# Altium project NIR-Spec-Sensor-Board.PrjPcb
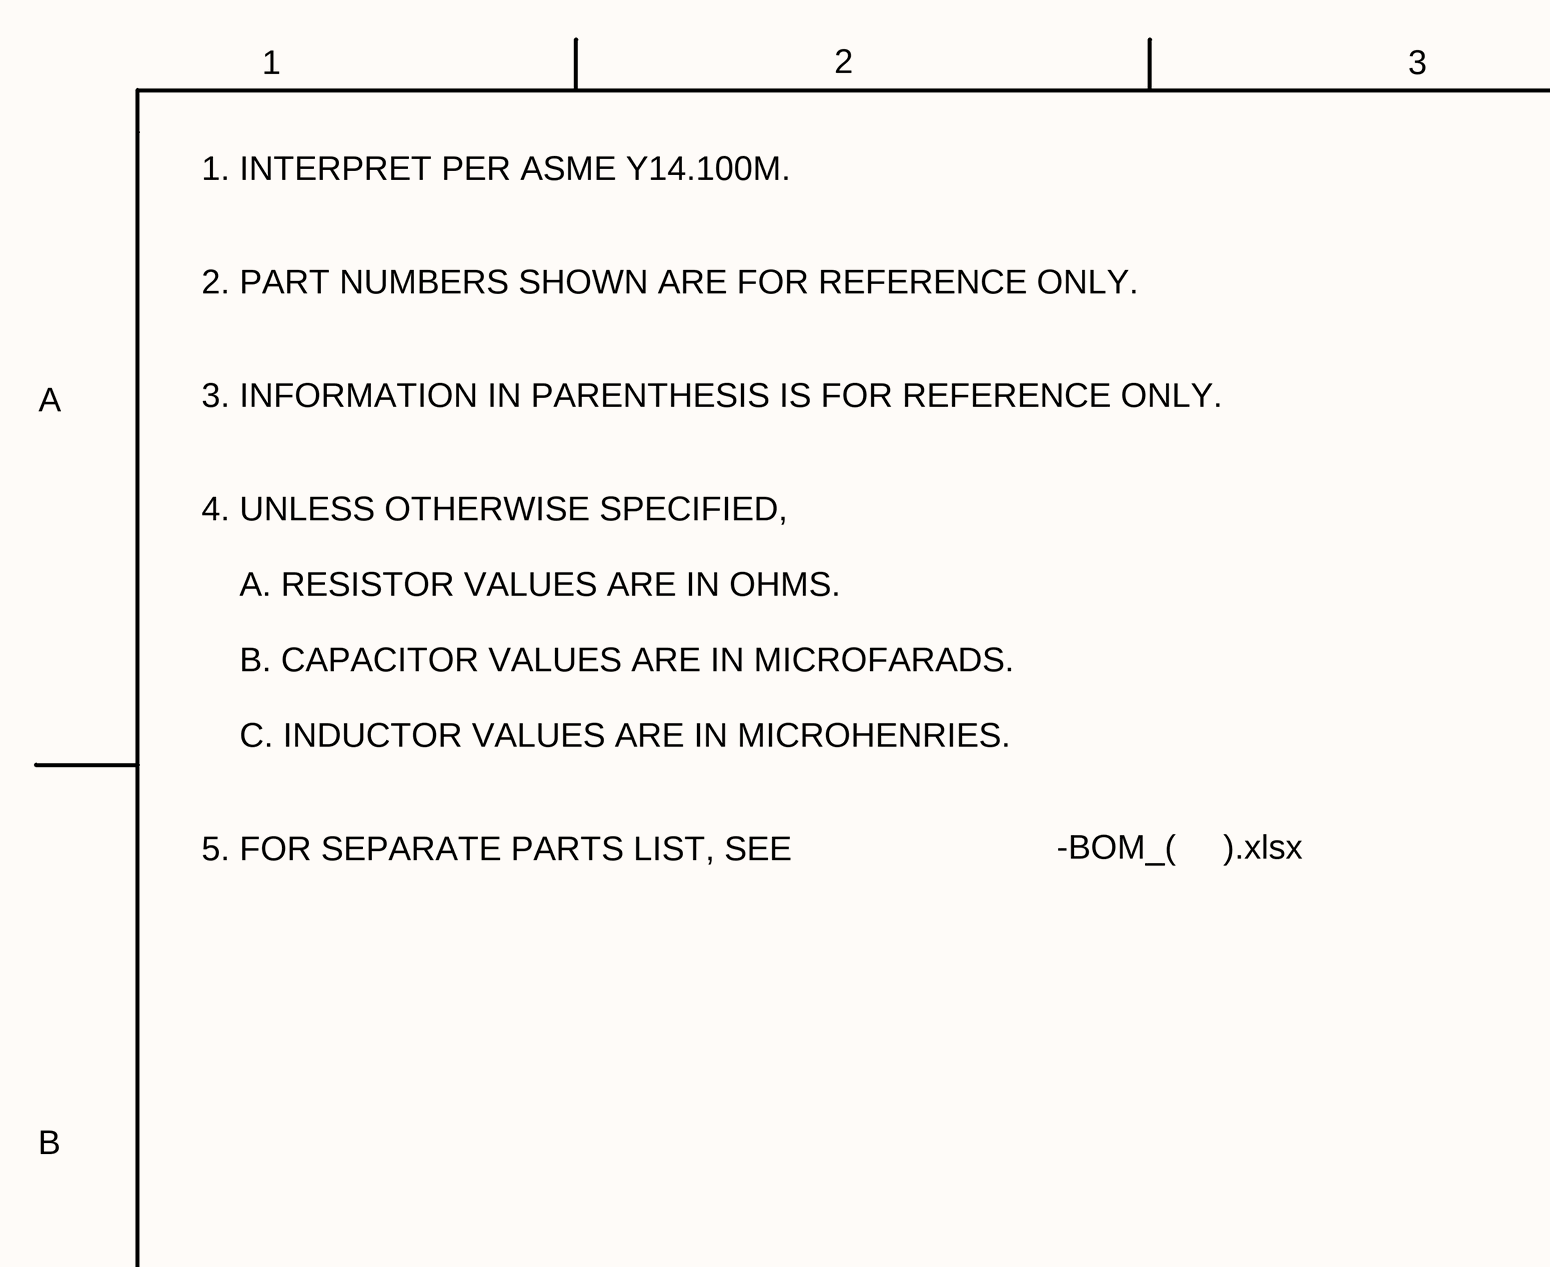
[diagram p0: G8160-03-Sensor-Board-SCH_SH1_(02).SchDoc, top left]
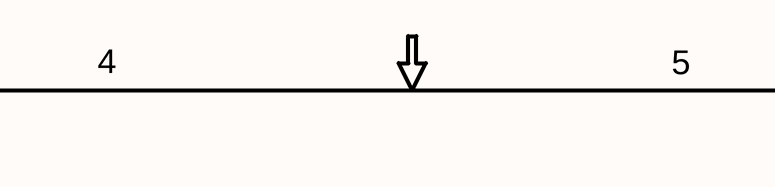
[diagram p1: G8160-03-Sensor-Board-SCH_SH1_(02).SchDoc, top middle]
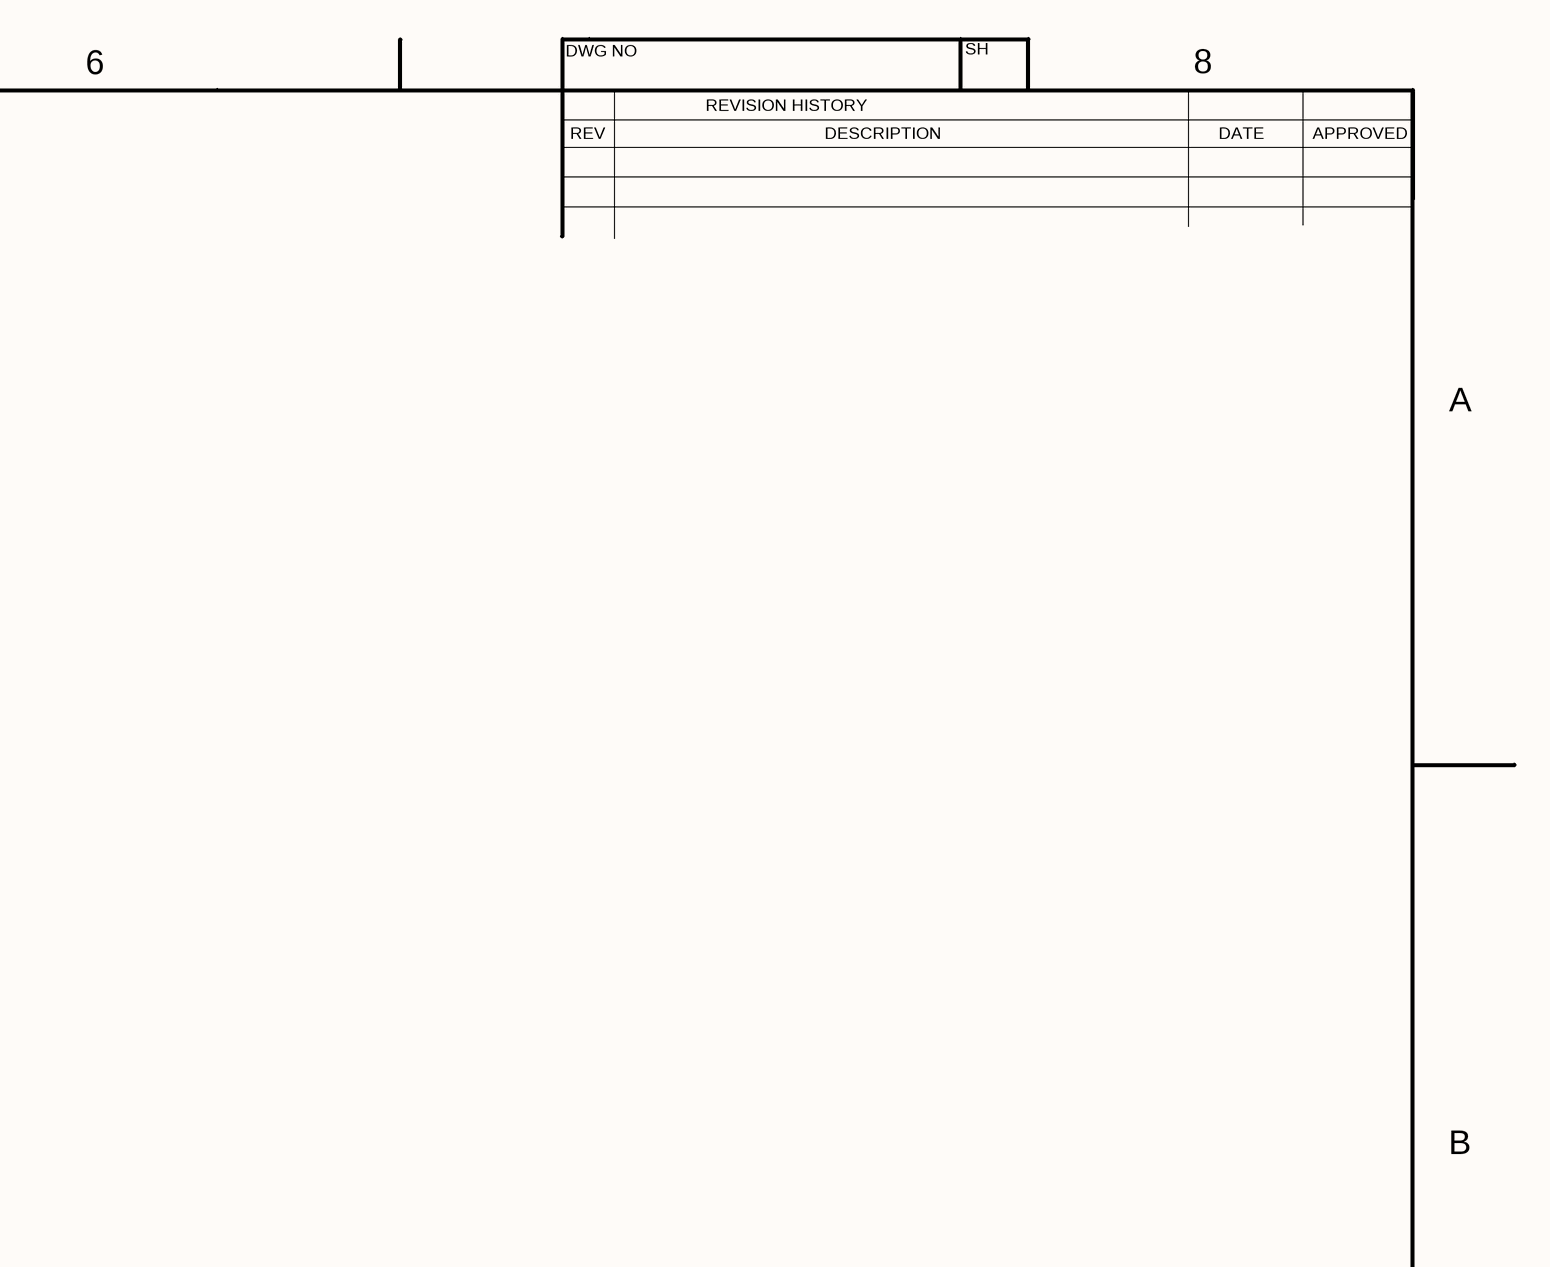
[diagram p2: G8160-03-Sensor-Board-SCH_SH1_(02).SchDoc, top right]
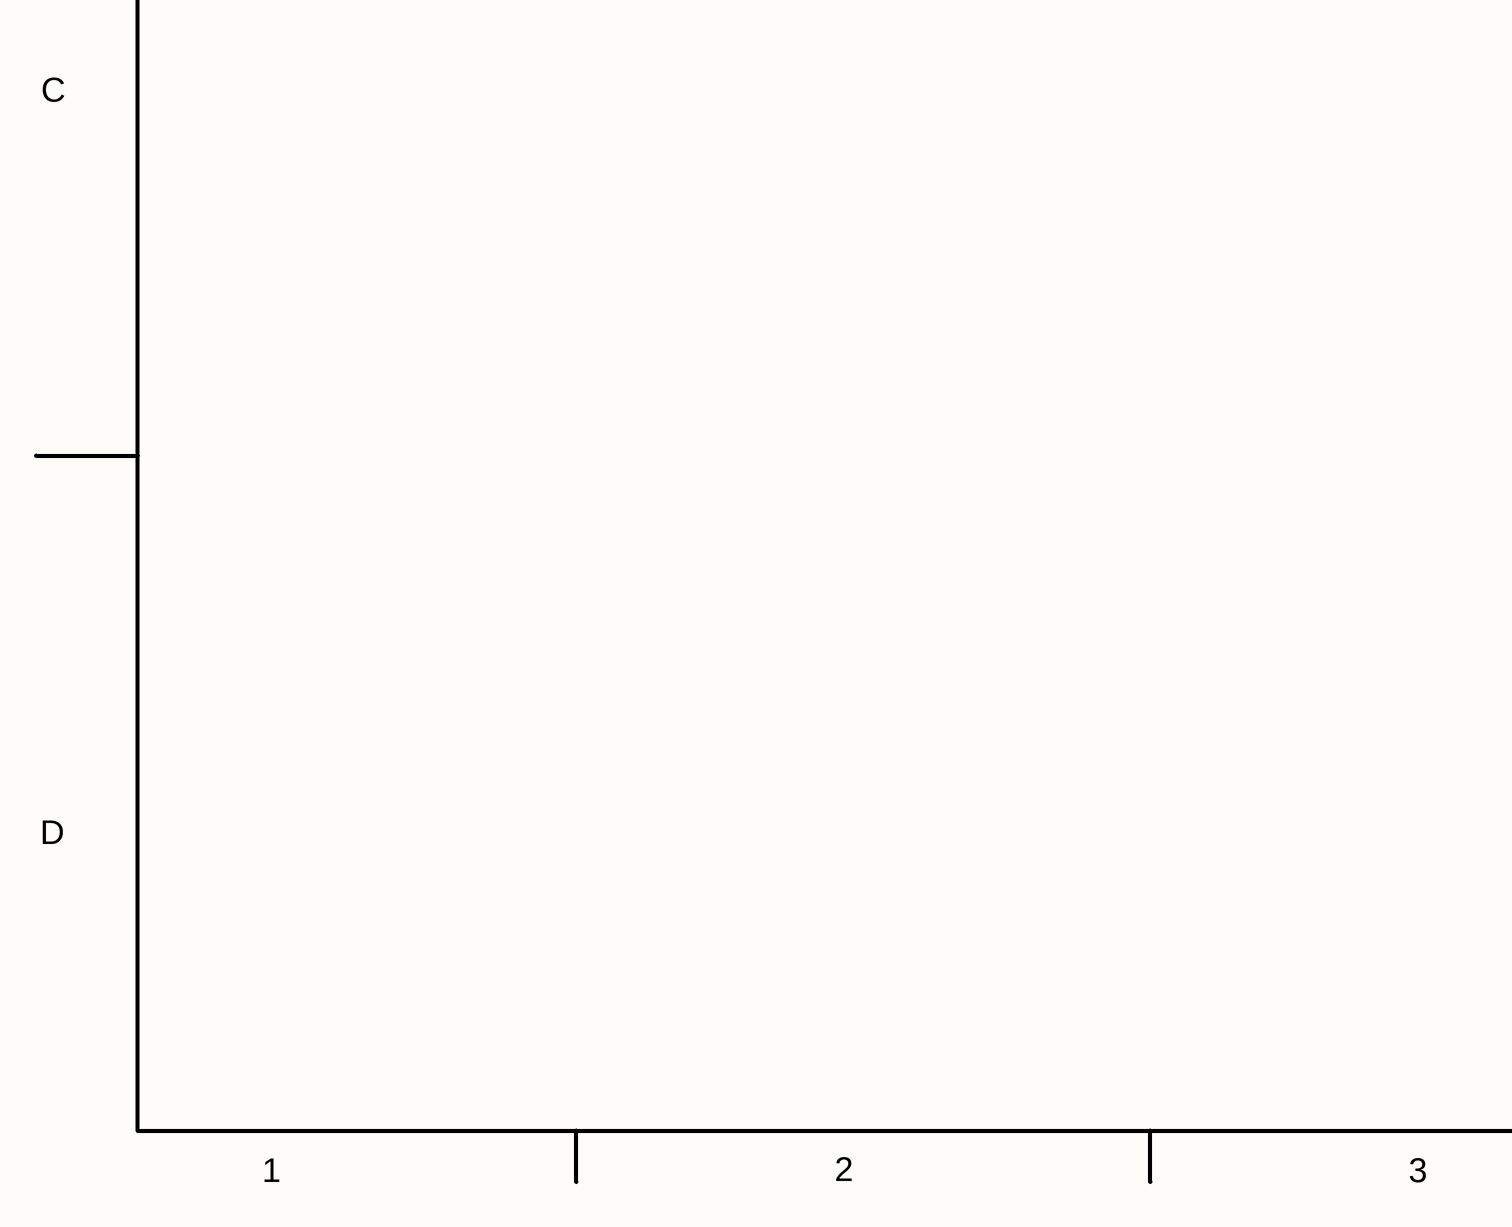
[diagram p3: G8160-03-Sensor-Board-SCH_SH1_(02).SchDoc, bottom left]
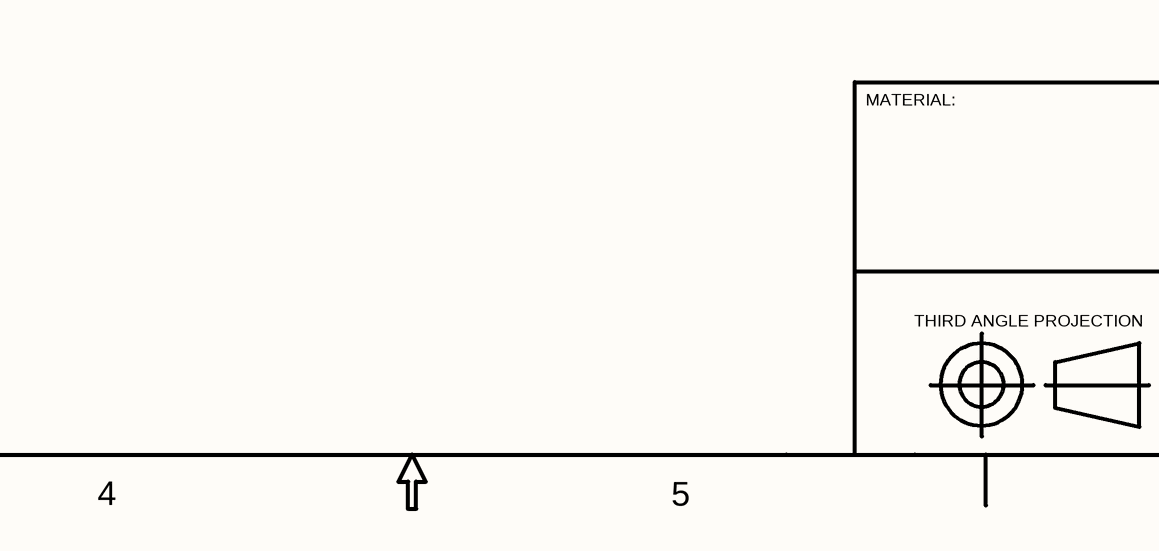
[diagram p4: G8160-03-Sensor-Board-SCH_SH1_(02).SchDoc, bottom middle]
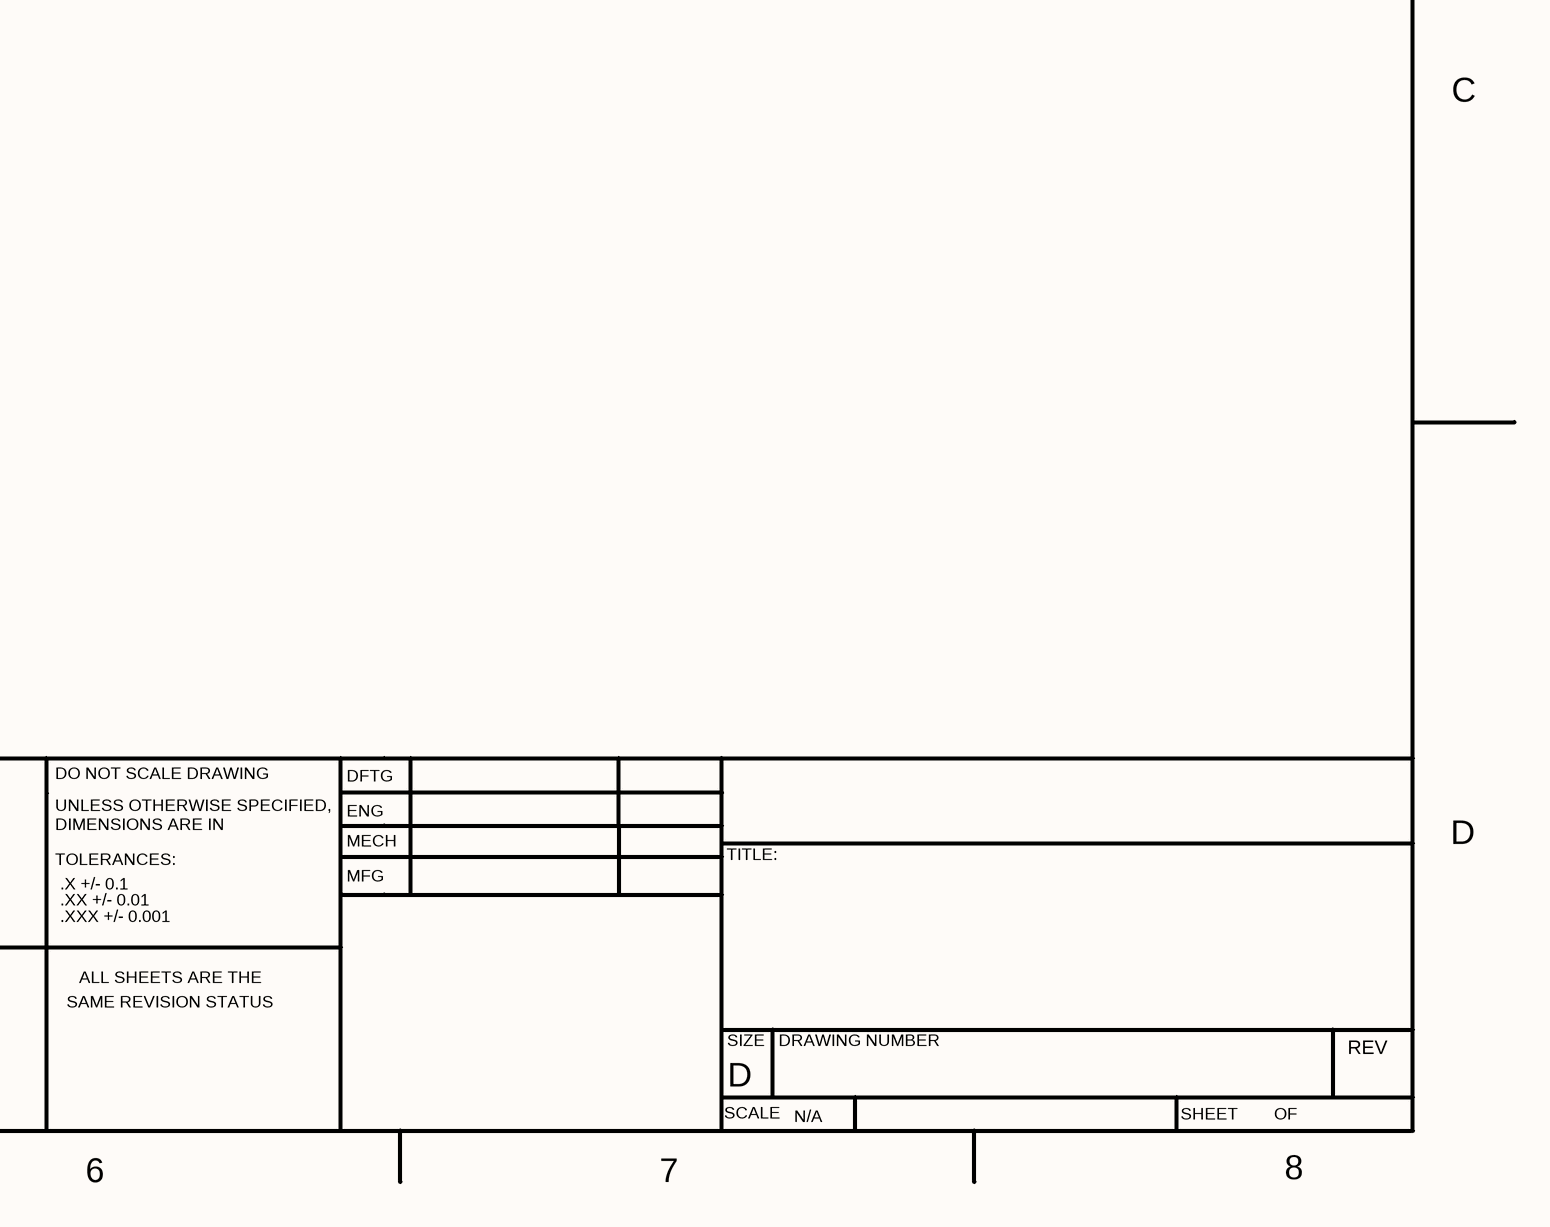
[diagram p5: G8160-03-Sensor-Board-SCH_SH1_(02).SchDoc, bottom right]
Company: -; DateDftg: -; DateEng: 06/13/22; DocNumber: NIR-Spec-Sensor; DocNumberPCB: NIR-Spec-Sensor-PCB; Hist1Appr: -; Hist1Date: -; Hist1Desc: -; Hist1Rev: -; Hist2Appr: -; Hist2Date: -; Hist2Desc: -; Hist2Rev: -; Hist3Appr: -; Hist3Date: -; Hist3Desc: -; Hist3Rev: -; NameDftg: K. KIDD; NameEng: K. KIDD; Rev: 02; Title0: NIR Spec; Title1: G8160-3 Sensor Board; TitleCCA: CIRCUIT CARD ASSEMBLY,; TitlePCB: PRINTED CIRCUIT BOARD,; TitleSCH: SCHEMATIC, CCA,
2 sheets, 15 parts. Net scope: global (net labels, ports and power ports of the same name join across sheets).
Board file: G8160-03-Sensor-Board.PcbDoc
Sheets:
  G8160-03-Sensor-Board-SCH_SH1_(02).SchDoc
  G8160-03-Sensor-Board-SCH_SH2_(02).SchDoc

## Sheet G8160-03-Sensor-Board-SCH_SH1_(02).SchDoc: SCHEMATIC, CCA,
size 863 x 558 mm; DocumentNumber: XXX-20XXX-XXX; SheetNumber: 1; SheetTotal: 2

### Notes on the sheet
- 1
- 2
- 3
- 4
- 5
- 6
- DWG NO
- REVISION HISTORY
- SH
- 8
- REV
- DESCRIPTION
- DATE
- APPROVED
- A
- -BOM_(
- ).xlsx
- 1. INTERPRET PER ASME Y14.100M.
  2. PART NUMBERS SHOWN ARE FOR REFERENCE ONLY.
  3. INFORMATION IN PARENTHESIS IS FOR REFERENCE ONLY.
  4. UNLESS OTHERWISE SPECIFIED,
  A. RESISTOR VALUES ARE IN OHMS.
  B. CAPACITOR VALUES ARE IN MICROFARADS.
  C. INDUCTOR VALUES ARE IN MICROHENRIES.
  5. FOR SEPARATE PARTS LIST, SEE
- B
- C
- MATERIAL:
- DO NOT SCALE DRAWING
- UNLESS OTHERWISE SPECIFIED,
- ENG
- DFTG
- D
- DIMENSIONS ARE IN
- TOLERANCES:
- MECH
- MFG
- TITLE:
- .X +/- 0.1
- .XX +/- 0.01
- .XXX +/- 0.001
- THIRD ANGLE PROJECTION
- SAME REVISION STATUS
- ALL SHEETS ARE THE
- SIZE
- DRAWING NUMBER
- SCALE
- N/A
- SHEET        OF
- 7

## Sheet G8160-03-Sensor-Board-SCH_SH2_(02).SchDoc: SCHEMATIC
size 863 x 558 mm; DocumentNumber: XXX-20XXX-XXX; SheetNumber: 2; SheetTotal: 2; PageSetup: Record=PageOptions|CenterHorizontal=True|CenterVertical=True|PrintScale=0.98|XCorrection=1.00|YCorrection=1.00|PrintKind=2|BorderSize=5000000|LeftOffset=0|BottomOffset=0|Orientation=2|PaperLength=1000|PaperWidth=1000|Scale=100|PaperSource=15|PrintQuality=1200|MediaType=1|DitherType=10|PaperKind=11 x 17|PrintScaleMode=1
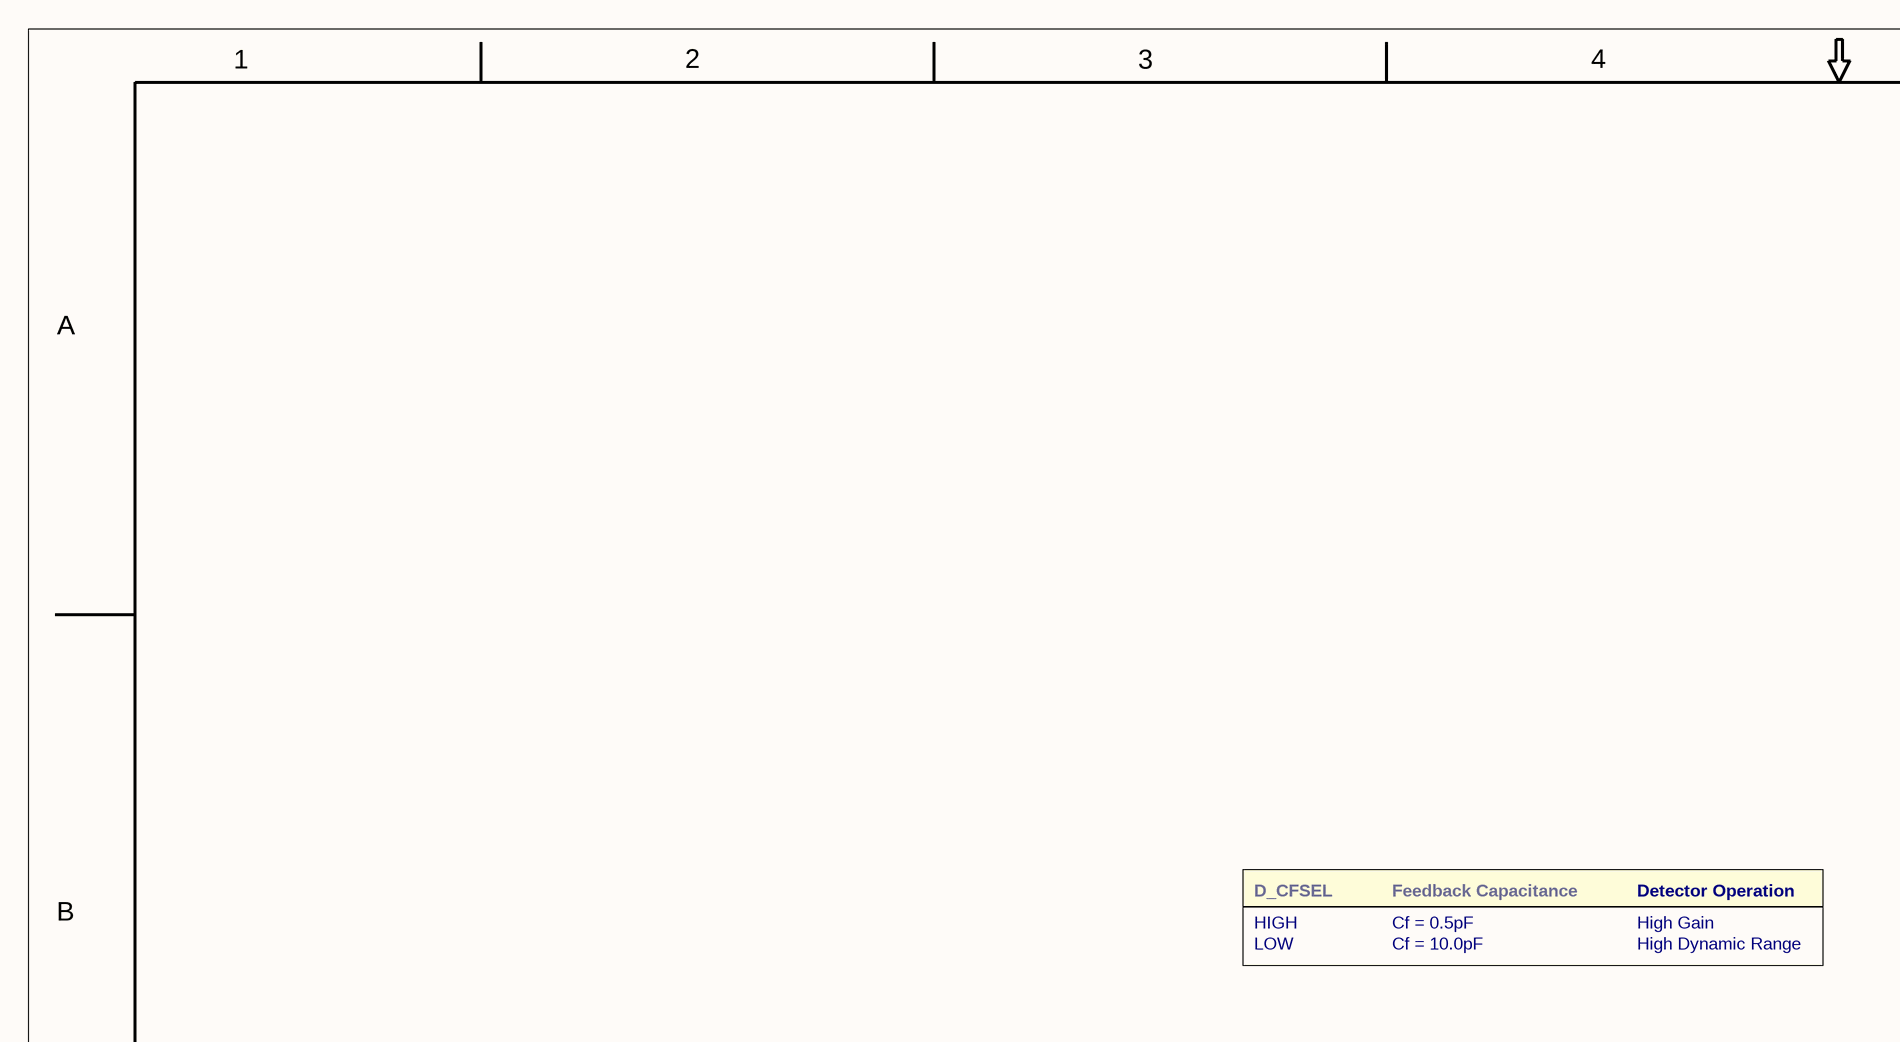
[diagram p6: G8160-03-Sensor-Board-SCH_SH2_(02).SchDoc, top left]
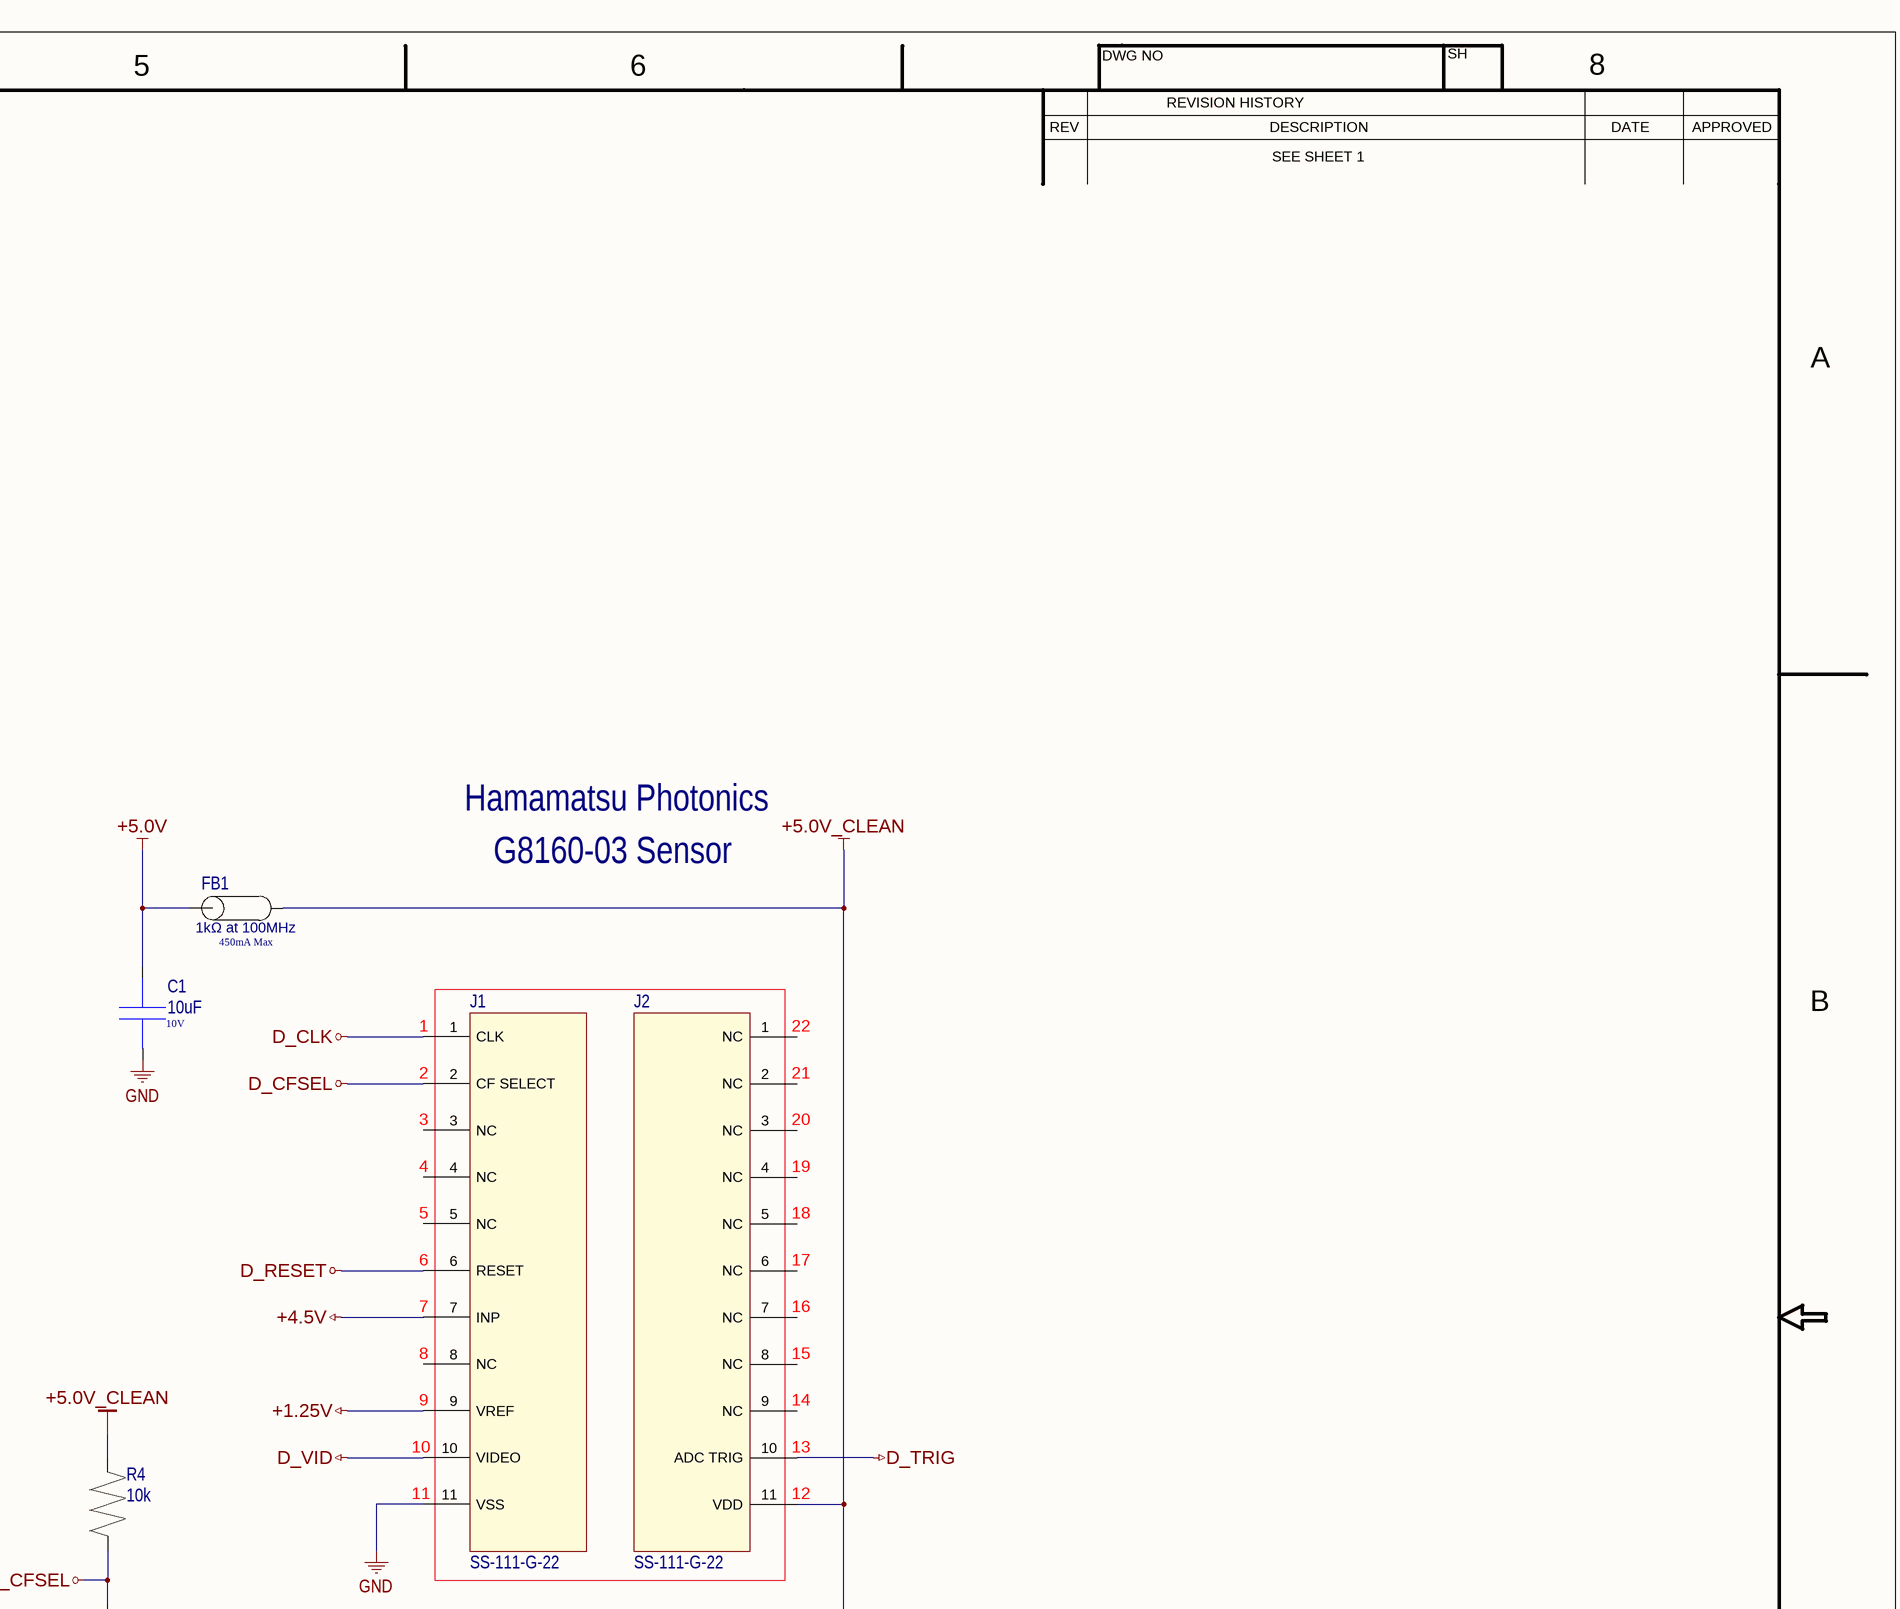
[diagram p7: G8160-03-Sensor-Board-SCH_SH2_(02).SchDoc, top right]
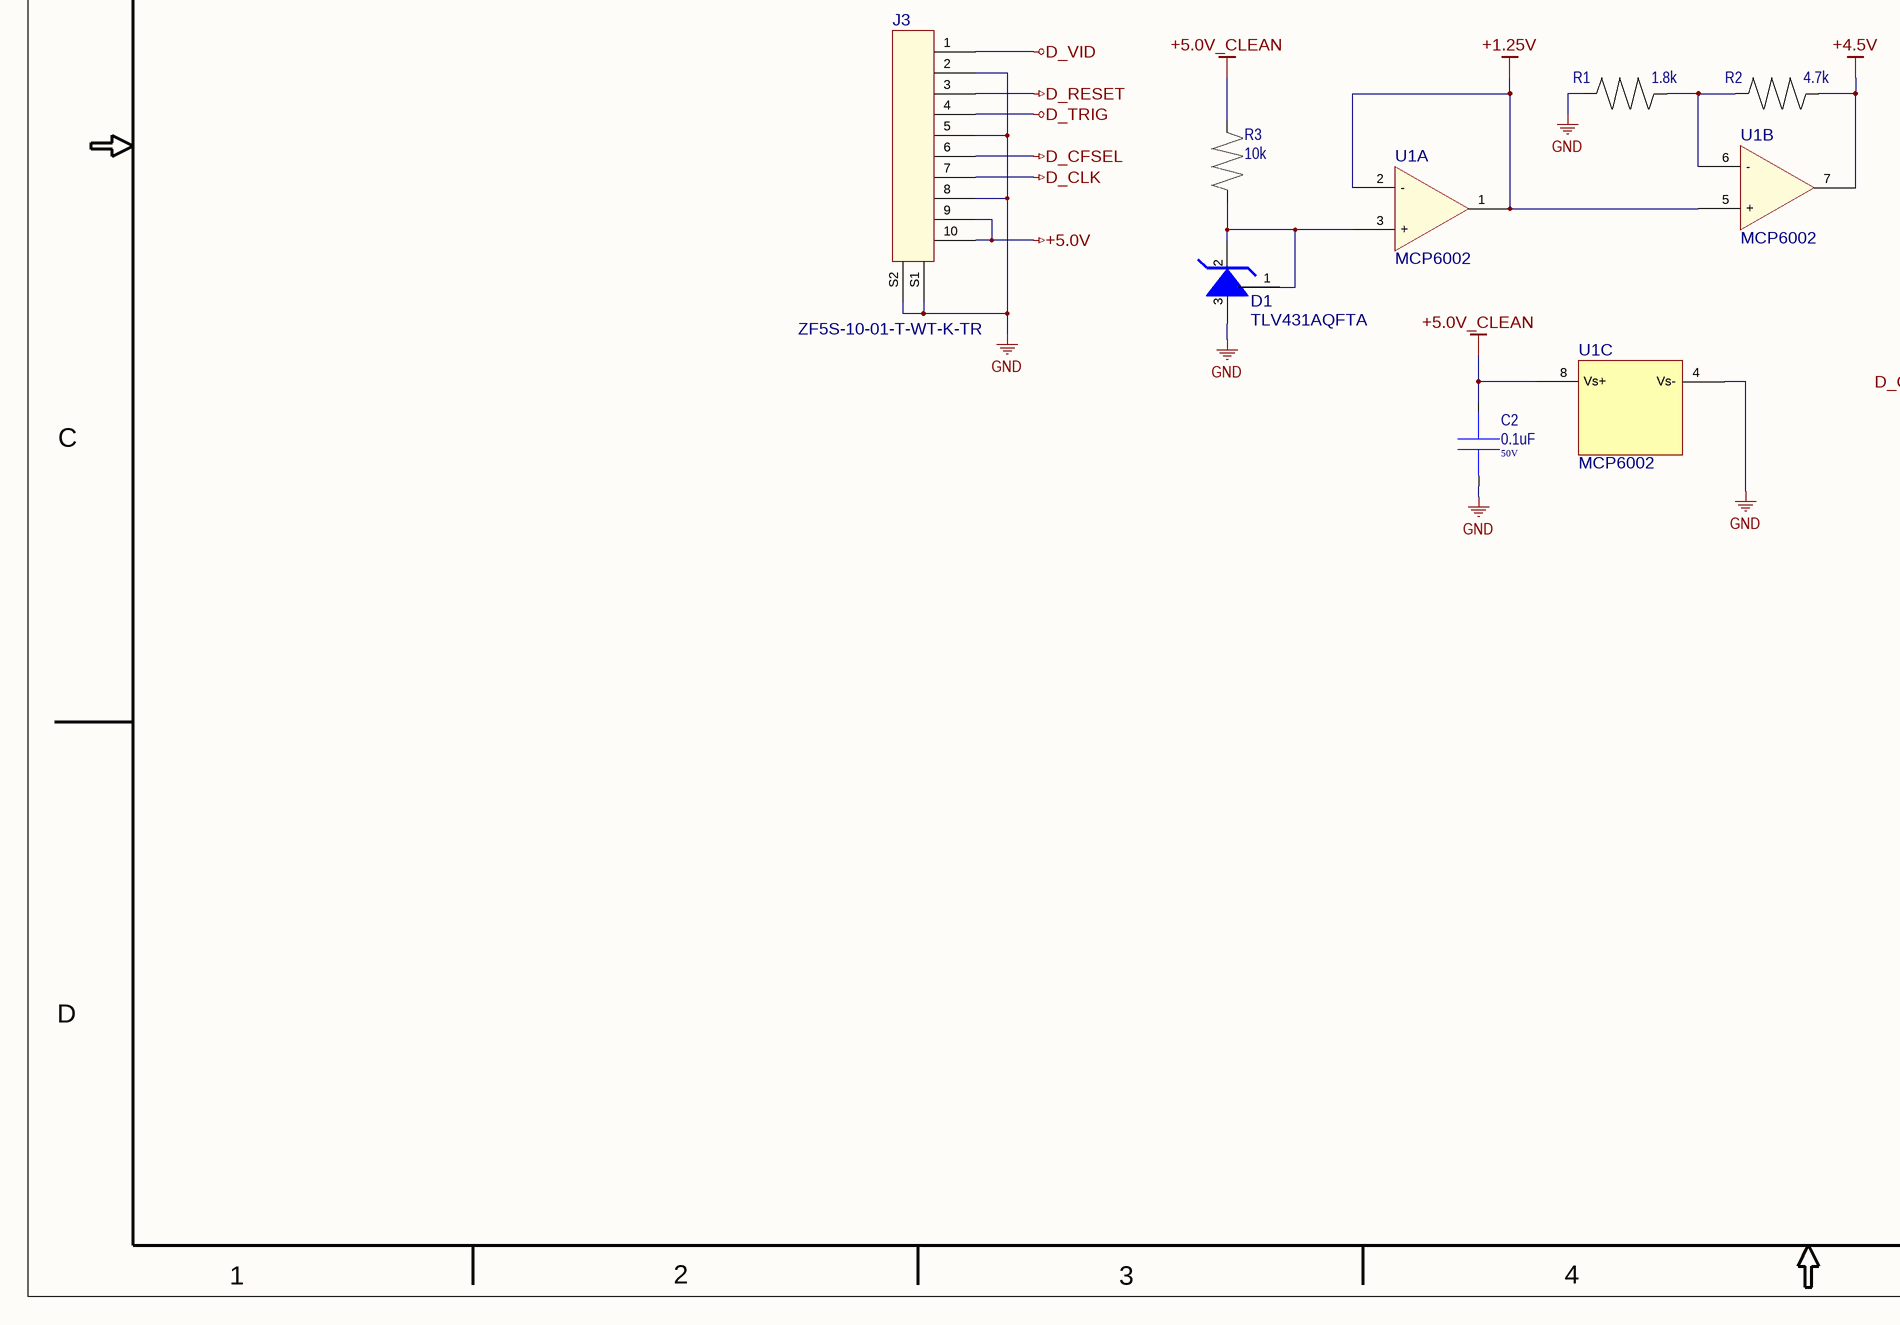
[diagram p8: G8160-03-Sensor-Board-SCH_SH2_(02).SchDoc, bottom left]
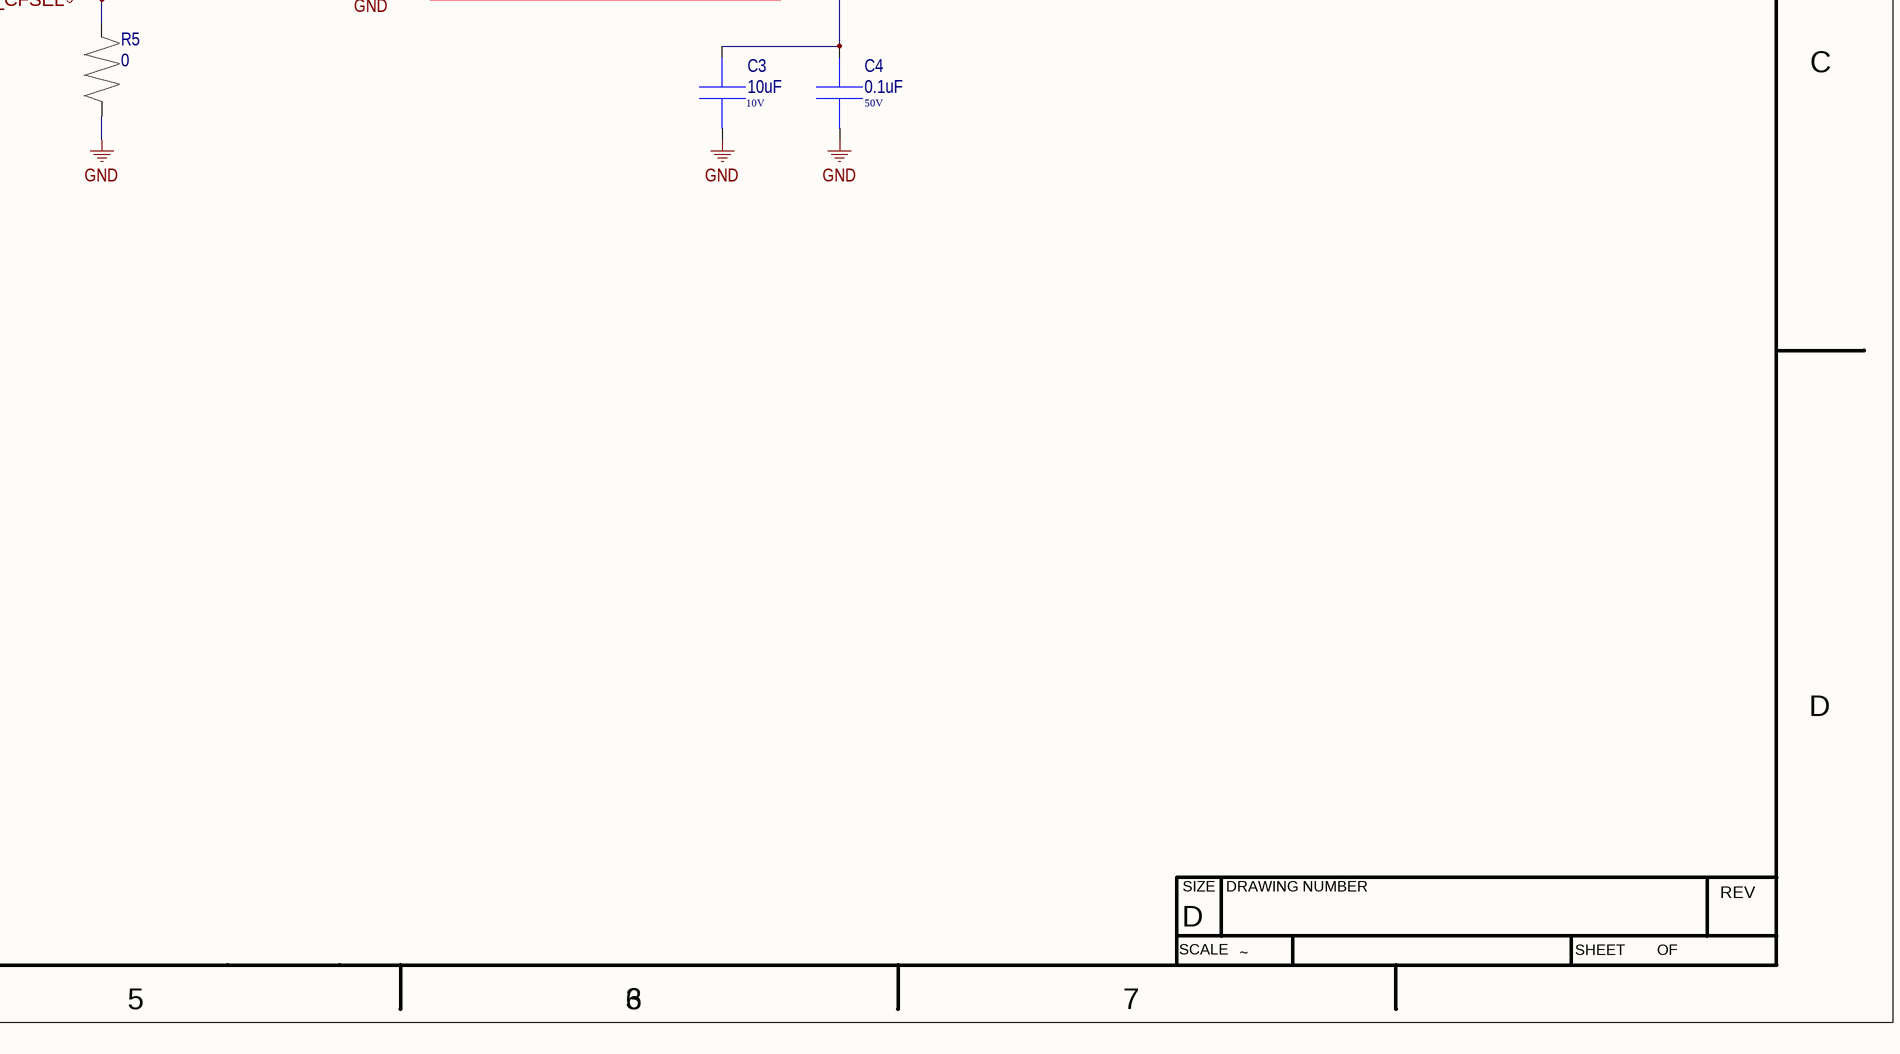
[diagram p9: G8160-03-Sensor-Board-SCH_SH2_(02).SchDoc, bottom right]

### Parts
C1  10uF  Voltage: 10V  [0402]
C2  0.1uF  Voltage: 50V  [0402]
C3  10uF  Voltage: 10V  [0402]
C4  0.1uF  Voltage: 50V  [0402]
D1  TLV431AQFTA  [SOT-23-3]
FB1  Rated Current: 450mA Max  Impedance: 1kΩ at 100MHz  [0402]  (hidden comment: Ferrite_Bead)
J1  SS-111-G-22  [SL-111-TT-11]
J2  SS-111-G-22  [SL-111-TT-11]
J3  ZF5S-10-01-T-WT-K-TR  [ZF5S-10-01-T-WT-K-TR]
R1  1.8k  [0402]
R2  4.7k  [0402]
R3  10k  [0402]
R4  10k  [0402]
R5  0  [0402]
U1  MCP6002  [SOIC_8]  (parts A,B,C of 3)

### Nets
+1.25V: J1.9(VREF) U1.1(OUT) U1.2(-) U1.5(+)
+4.5V: J1.7(INP) R2.1 U1.7(OUT)
+5.0V: C1.2 FB1.1 J3.9 J3.10
+5.0V_CLEAN: C2.2 C3.2 C4.2 FB1.2 J2.11(VDD) R3.2 R4.2 U1.8(Vs+)
D_CFSEL: J1.2(CF_SELECT) J3.6 R4.1 R5.2
D_CLK: J1.1(CLK) J3.7
D_RESET: J1.6(RESET) J3.3
D_TRIG: J2.10(ADC_TRIG) J3.4
D_VID: J1.10(VIDEO) J3.1
GND: C1.1 C2.1 C3.1 C4.1 D1.3(A) J1.11(VSS) J3.2 J3.5 J3.8 J3.S1 J3.S2 R1.2 R5.1 U1.4(Vs-)
NetD1_1: D1.1(REF) D1.2(K) R3.1 U1.3(+)
NetR1_1: R1.1 R2.2 U1.6(-)

Not connected (* = marked no-connect by the designer): J1 3(NC) 4(NC) 5(NC) 8(NC); J2 1(NC) 2(NC) 3(NC) 4(NC) 5(NC) 6(NC) 7(NC) 8(NC) 9(NC)

### Notes on the sheet
- 1
- 2
- 3
- 4
- 5
- 6
- DWG NO
- REVISION HISTORY
- SH
- 8
- REV
- DESCRIPTION
- SEE SHEET 1
- DATE
- APPROVED
- A
- Hamamatsu Photonics
- G8160-03 Sensor
- D_CFSEL
- Feedback Capacitance
- Detector Operation
- B
- HIGH
- LOW
- Cf = 0.5pF
- Cf = 10.0pF
- High Gain
- High Dynamic Range
- (near J1) 1
- (near J2) 22
- (near J1) 2
- (near J2) 21
- (near J1) 3
- (near J2) 20
- (near J1) 4
- (near J1) 5
- (near J2) 19
- (near J2) 18
- (near J1) 6
- (near J2) 17
- (near J1) 7
- (near J2) 16
- (near J1) 8
- (near J2) 15
- (near J1) 10
- (near J1) 9
- (near J2) 14
- (near J2) 13
- (near J1) 11
- (near J2) 12
- C
- D
- SIZE
- DRAWING NUMBER
- SCALE
- ~
- SHEET        OF
- 7

### Library data of the parts
C1 C3 = CAP: CAP CER 10UF 10V X6S 0603; Part Number: GRM188C81A106MA73D; Manufacturer: Murata Electronics
C2 C4 = CAP: CAP CER 0.1UF 50V X7R 0603; Part Number: C0603C104K5RAC3121; Manufacturer: KEMET
D1 = TLV431AQFTA: Shunt Voltage Reference IC Adjustable 1.24V 18 VV ±1% 15 mA SOT-23-3; Manufacturer: Diodes Incorporated; Part Number: TLV431AQFTA
FB1 = Ferrite_Bead: Ferrite Beads 1000 OHM 25%; Manufacturer: Murata Electronics; Part Number: BLM18AG102SH1D; ClassName: 3.3V Regulator
J1 J2 = SL-111-TT-11: CONN RCPT .100" 11POS TIN PCB; Manufacturer: Samtec; Model Number: SS-111-G-22
J3 = ZF5S-10-01-T-WT-K-TR: Manufacturer: Samtec; Part Number: ZF5S-10-01-T-WT-K-TR
R1-R5 = RES: Part Number: -; Manufacturer: -
U1 = AD8072: IC OPAMP VIDEO DUAL 8MSOP; Part Number: AD8072ARMZ; Manufacturer: Analog Devices Inc.